# EAGLE design SmodCON3 (EAGLE 6.3)
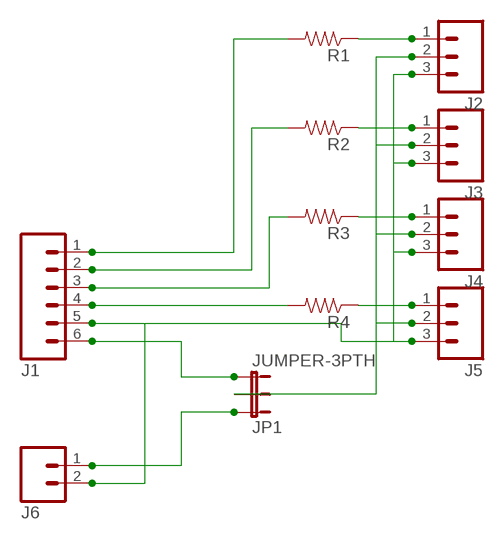
[diagram p0: schematic, sheet 1]

## Parts
J1  M06SIP  [1X06]
J2  M03PTH  [1X03]
J3  M03PTH  [1X03]
J4  M03PTH  [1X03]
J5  M03PTH  [1X03]
J6  M023.5MM  [SCREWTERMINAL-3.5MM-2]
JP1  JUMPER-3PTH  [1X03]
R1  RESISTOR0603-RES  [0603-RES]
R2  RESISTOR0603-RES  [0603-RES]
R3  RESISTOR0603-RES  [0603-RES]
R4  RESISTOR0603-RES  [0603-RES]

## Nets
GND: J1.5 J2.3 J3.3 J4.3 J5.3 J6.2
N$5: J2.1 R1.1
N$6: J3.1 R2.1
N$7: J4.1 R3.1
N$8: J5.1 R4.1
P1: J1.1 R1.2
P2: J1.2 R2.2
P3: J1.3 R3.2
P4: J1.4 R4.2
VCC: J1.6 JP1.3
VE: J6.1 JP1.1
VS: J2.2 J3.2 J4.2 J5.2 JP1.2

## Library data of the parts
J1 = 1x05smd:M06: Header 6 Standard 6-pin 0.1" header. Use with straight break away headers (SKU : PRT-00116), right angle break away headers (PRT-00553), swiss pins (PRT-00743), machine pins (PRT-00117), and female headers (PRT-00115). Molex polarized connector foot print use with SKU : PRT-08094 with associated crimp pins and housings. NOTES ON THE VARIANTS LOCK and LOCK_LONGPADS... This footprint was designed to help hold the alignment of a through-hole component (i.e. 6-pin header) while soldering it into place. You may notice that each hole has been shifted either up or down by 0.005 of an inch from it's more standard position (which is a perfectly straight line). This slight alteration caused the pins (the squares in the middle) to touch the edges of the holes. Because they are alternating, it causes a "brace" to hold the component in place. 0.005 has proven to be the perfect amount of "off-center" position when using our standard breakaway headers. Although looks a little odd when you look at the bare footprint, once you have a header in there, the alteration is very hard to notice. Also, if you push a header all the way into place, it is covered up entirely on the bottom side. This idea of altering the position of holes to aid alignment will be further integrated into the Sparkfun Library for other footprints. It can help hold any component with 3 or more connection pins.
J2-J5 = 1x05smd:M03: Header 3 Standard 3-pin 0.1" header. Use with straight break away headers (SKU : PRT-00116), right angle break away headers (PRT-00553), swiss pins (PRT-00743), machine pins (PRT-00117), and female headers (PRT-00115). Molex polarized connector foot print use with SKU : PRT-08232 with associated crimp pins and housings.
J6 = 1x05smd:M02: Header 2 Standard 2-pin 0.1" header. Use with straight break away headers (SKU : PRT-00116), right angle break away headers (PRT-00553), swiss pins (PRT-00743), machine pins (PRT-00117), and female headers (PRT-00115). Molex polarized connector foot print use with SKU : PRT-08233 with associated crimp pins and housings.
JP1 = SparkFun-Passives:JUMPER-3
R1-R4 = SparkFun-Passives:RESISTOR: Resistor Basic schematic elements and footprints for 0603, 1206, and PTH resistors.

## Board
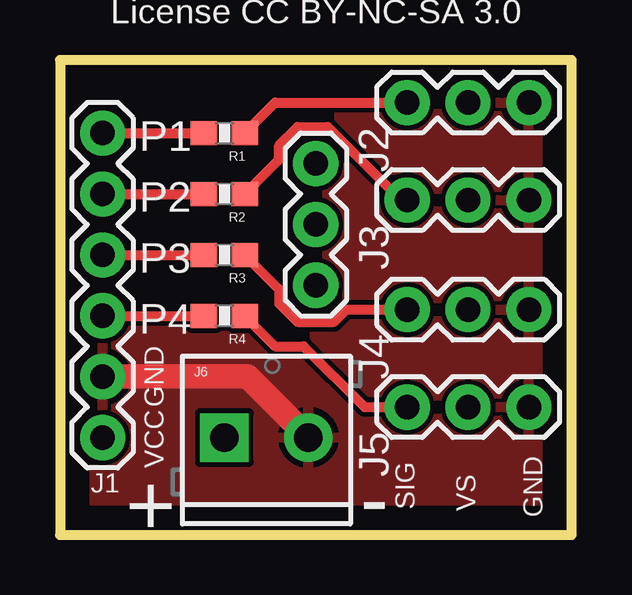
[diagram p1: board, top side]
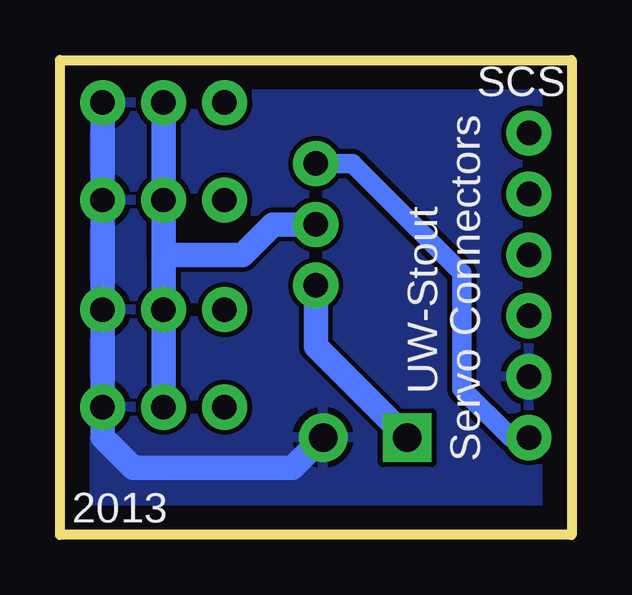
[diagram p2: board, bottom side, seen from below]

Size 21.34 x 19.81 mm. Coordinates in mm from the lower left corner, seen from the top.
Outline: 0,0 21.34,0 21.34,19.81 0,19.81 0,0
Copper layers (1*16): Top 0.035mm / dielectric 1.5mm / Bottom 0.035mm
Design rules "default": minimum track width 10mil, minimum drill 24mil, track to track 8mil, track to pad 8mil, pad to pad 8mil, via to via 8mil, smd to smd 8mil, copper to edge 40mil, drill to drill 8mil, minimum pad ring 10mil, minimum via ring 8mil, stop-mask expansion 4mil, vias tented up to drill 0mil, thermal gap 10mil

### Footprints (pad centres in the part's own frame; a part is rotated, then mirrored left to right if it is on the bottom)
1X06 = drill 1.016 pad 1.88: 1 0,0; 2 2.54,0; 3 5.08,0; 4 7.62,0; 5 10.16,0; 6 12.7,0
1X03 = drill 1.016 pad 1.88: 1 0,0; 2 2.54,0; 3 5.08,0
SCREWTERMINAL-3.5MM-2 = drill 1.2 pad 2.032 square: 1 0,0 | drill 1.2 pad 2.032: 2 3.5,0
0603-RES = smd 1.1 x 1: 1 -0.85,0; 2 0.85,0

### Placement (x,y rotation side)
J1  1.78,16.76 270 top
J2  14.48,18.03 0 top
J3  14.48,13.97 0 top
J4  14.48,9.4 0 top
J5  14.48,5.33 0 top
J6  6.86,4.06 0 top
JP1  10.67,10.41 90 top
R1  6.86,16.76 180 top
R2  6.86,14.22 180 top
R3  6.86,11.68 180 top
R4  6.86,9.14 180 top

### Tracks (layer width: path | path; a pad name or v marks a point on that pad's centre or on a via)
GND
  Top 1.016: J1.5 7.82,6.6 J6.2
  Bottom 1.016: J2.3 J3.3 J4.3 J5.3 19.56,4.06 18.29,2.79 11.63,2.79 J6.2
  pour Bottom: 0,0 21.34,0 21.34,19.81 0,19.81
  pour Top: 0,0 21.34,0 21.34,19.81 0,19.81
N$5
  Top 0.406: R1.1 8.98,18.03 J2.1
N$6
  Top 0.406: R2.1 9.14,15.66 9.14,16.26 9.91,17.02 11.18,17.02 14.48,13.72 J3.1
N$7
  Top 0.406: R3.1 9.14,10.25 9.14,9.65 9.91,8.89 11.43,8.89 11.94,9.4 J4.1
N$8
  Top 0.406: R4.1 8.98,7.87 10.16,7.87 12.7,5.33 J5.1
P1
  Top 0.406: J1.1 R1.2
P2
  Top 0.406: J1.2 R2.2
P3
  Top 0.406: J1.3 R3.2
P4
  Top 0.406: J1.4 R4.2
VCC
  Bottom 0.813: JP1.3 9.14,15.49 4.57,10.92 4.57,6.1 2.54,4.06 J1.6
VE
  Bottom 1.016: J6.1 10.67,7.87 JP1.1
VS
  Bottom 1.016: JP1.2 12.45,12.95 13.72,11.68 17.02,11.68 J3.2 | J3.2 J4.2 J5.2 | J2.2 J3.2

### Text on the board
_tsilk: Made by Shannon Strutz / For the University of Wisconsin - Stout / 2013 / / License CC BY-NC-SA 3.0 | P1 | P2 | P3 | P4 | GND | VCC | + | - | SIG | VS | GND | J1
_bsilk: SCS | Servo Connectors | UW-Stout | 2013